# EAGLE design noroshi_LoRa (EAGLE 8.2.2)
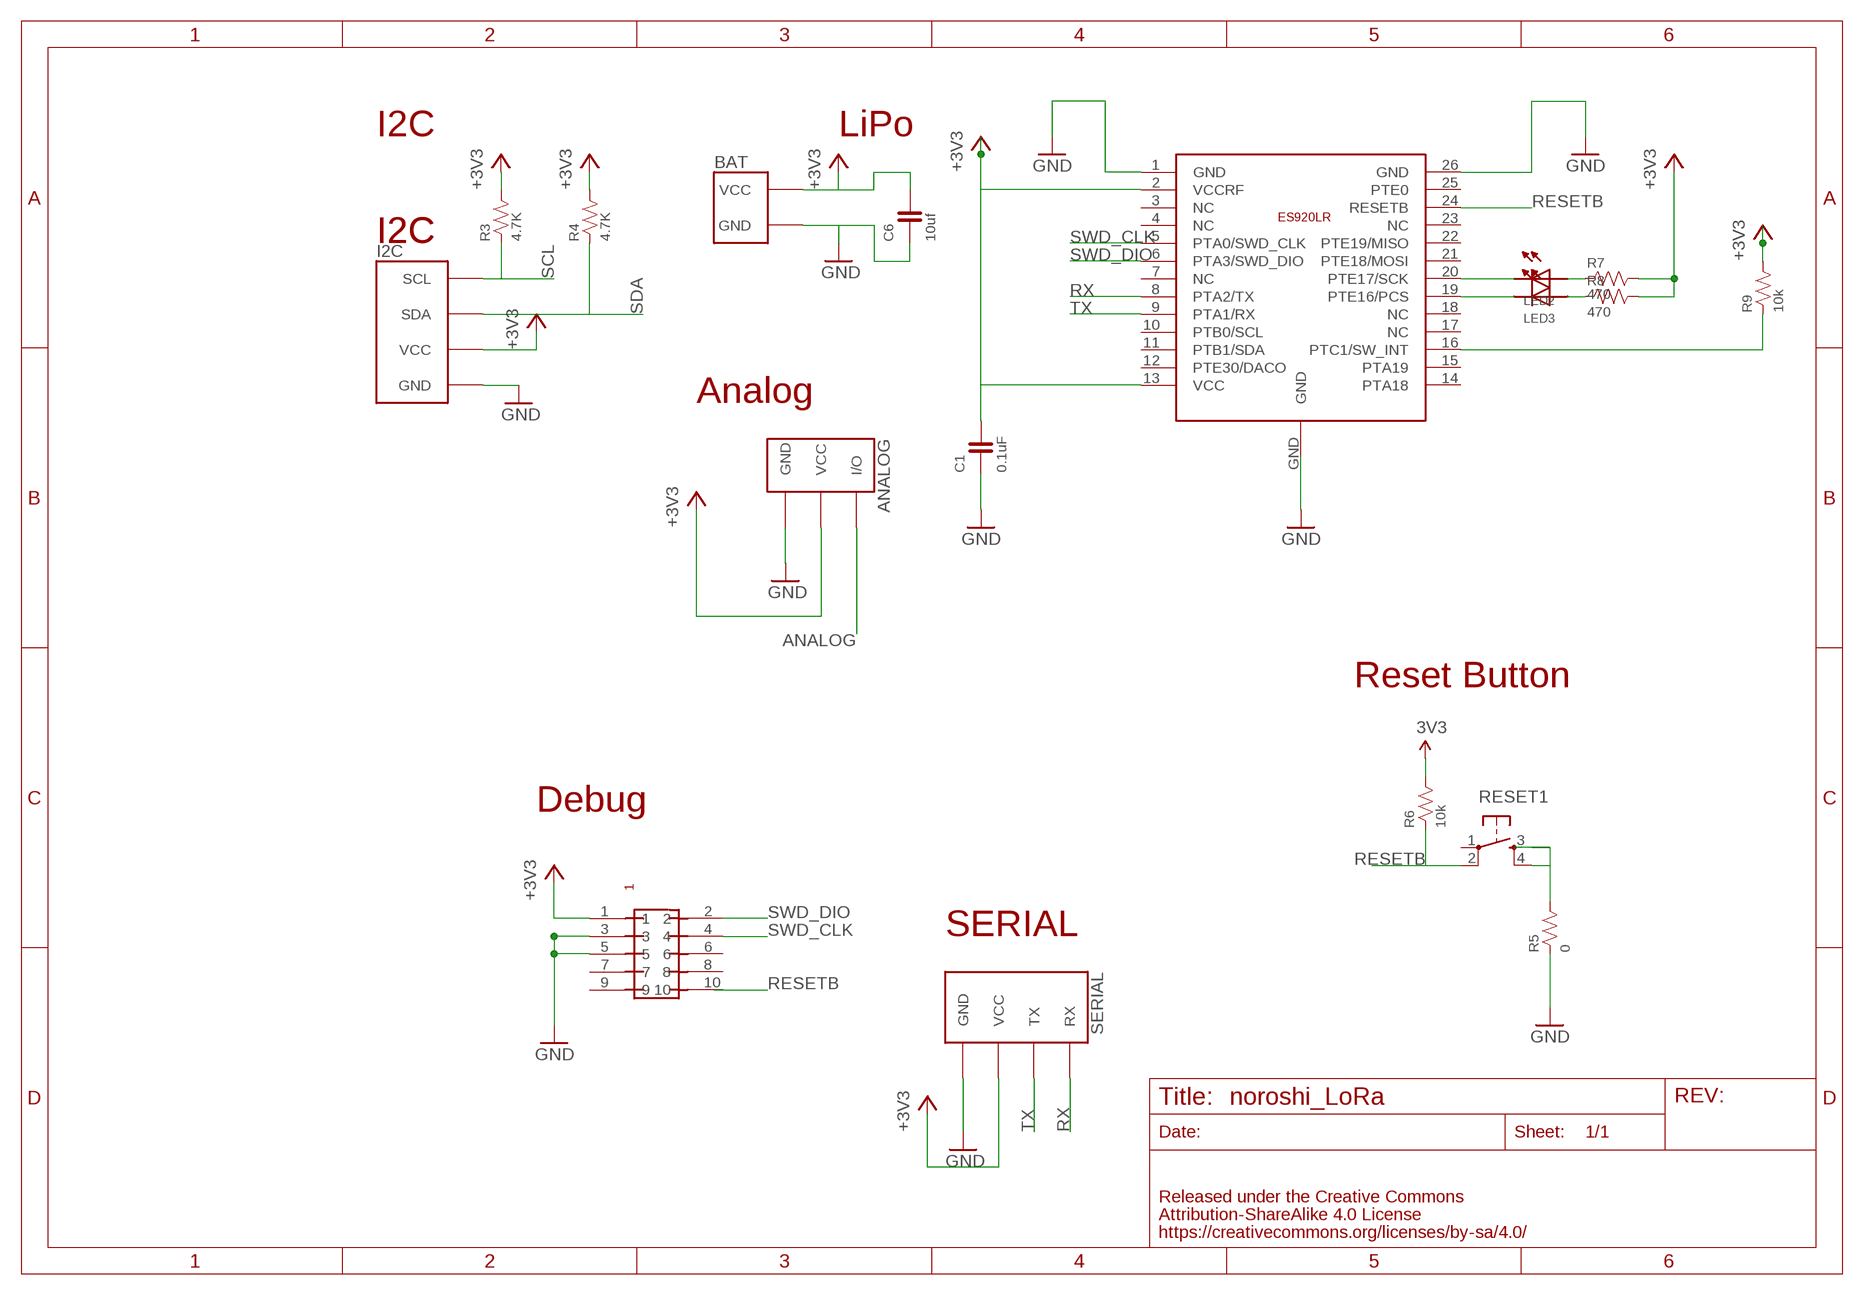
[diagram p0: schematic, sheet 1]

## Parts
ANALOG  FABO_BRICK_3PIN-S03B-PASK-2_LONG  [FABO_BRICK_3PIN_S03B-PASK-2_LONG]
BAT  FABO_BRICK_2PIN_SIDE  [FABO_BRICK_2PIN_S02B−PASK-2_SILK]
C1  0.1uF  CAPACITOR-0603_NARROW  [0603-NARROW]
C6  10uf  CAPACITOR-0603  [0603]
I2C  FABO_BRICK_I2C-S04B-PASK-2_LONG  [FABO_BRICK_I2C_S04B-PASK-2_LONG]
LED2  LED-0603  [0603]
LED3  LED-0603  [0603]
R3  4.7K  RESISTOR-0603  [0603]
R4  4.7K  RESISTOR-0603  [0603]
R5  0  RESISTOR-0603-NARROW  [0603-NARROW]
R6  10k  RESISTOR-0603-NARROW  [0603-NARROW]
R7  470  RESISTOR-0603-NARROW  [0603-NARROW]
R8  470  RESISTOR-0603-NARROW  [0603-NARROW]
R9  10k  RESISTOR-0603-NARROW  [0603-NARROW]
RESET1  TACT-SWITCH-SMD_KMR2  [KMR2]
SERIAL  FABO_BRICK_SERIAL-S04B-PASK-2_LONG  [FABO_BRICK_SERIAL_S04B-PASK-2_LONG]
U$2  ES920LR  [ES920LR]
U$8  PIN-HEADER-SMT(1.27MM)2X5  [PIN-HEADER-SMT(1.27MM)2X5]

## Nets
3V3: R6.2
+3V3: ANALOG.VCC BAT.VCC C1.2 C6.2 I2C.VCC R3.2 R4.2 R7.2 R8.2 R9.2 SERIAL.VCC U$2.2(VCCRF) U$2.13(VCC) U$8.1
ANALOG: ANALOG.I/O
GND: ANALOG.GND BAT.GND C1.1 C6.1 I2C.GND R5.1 SERIAL.GND U$2.1(GND) U$2.26(GND) U$2.GND U$8.3 U$8.5
N$4: LED3.CATHODE U$2.19(PTE16/PCS)
N$5: LED2.CATHODE U$2.20(PTE17/SCK)
N$6: LED2.ANODE R7.1
N$7: LED3.ANODE R8.1
N$8: R9.1 U$2.16(PTC1/SW_INT)
N$10: R5.2 RESET1.3 RESET1.4
RESETB: R6.1 RESET1.2 U$2.24(RESETB) U$8.10
RX: SERIAL.RX U$2.8(PTA2/TX)
SCL: I2C.SCL R3.1
SDA: I2C.SDA R4.1
SWD_CLK: U$2.5(PTA0/SWD_CLK) U$8.4
SWD_DIO: U$2.6(PTA3/SWD_DIO) U$8.2
TX: SERIAL.TX U$2.9(PTA1/RX)
Unconnected: RESET1.1 U$2.3(NC) U$2.4(NC) U$2.7(NC) U$2.10(PTB0/SCL) U$2.11(PTB1/SDA) U$2.12(PTE30/DACO) U$2.14(PTA18) U$2.15(PTA19) U$2.17(NC) U$2.18(NC) U$2.21(PTE18/MOSI) U$2.22(PTE19/MISO) U$2.23(NC) U$2.25(PTE0) U$8.6 U$8.7 U$8.8 U$8.9

## Notes on the sheet
- I2C | LiPo
- I2C | I2C
- Analog
- Reset Button
- Debug
- SERIAL

## Library data of the parts
ANALOG = FaBo-Template:FABO_BRICK_3PIN: FaBo Brick 3pin
BAT = FaBo-Template:FABO_BRICK_2PIN
C1 C6 = FaBo-Capacitor:CAPACITOR: CAPACITOR
I2C = FaBo-Template:FABO_BRICK_I2C: FaBo Brick I2C
LED2 LED3 = FaBo-LED:LED
R3-R9 = FaBo-Resistors:RESISTOR: RESISTOR
RESET1 = FaBo-Switch:TACT-SWITCH
SERIAL = FaBo-Template:FABO_BRICK_SERIAL: FaBo Brick Serial
U$2 = FaBo-LoRa:ES920LR
U$8 = gclue:PIN-HEADER-SMT(1.27MM)2X5: PIN-HEADER-SMT (1.27MM) 2x5

## Board
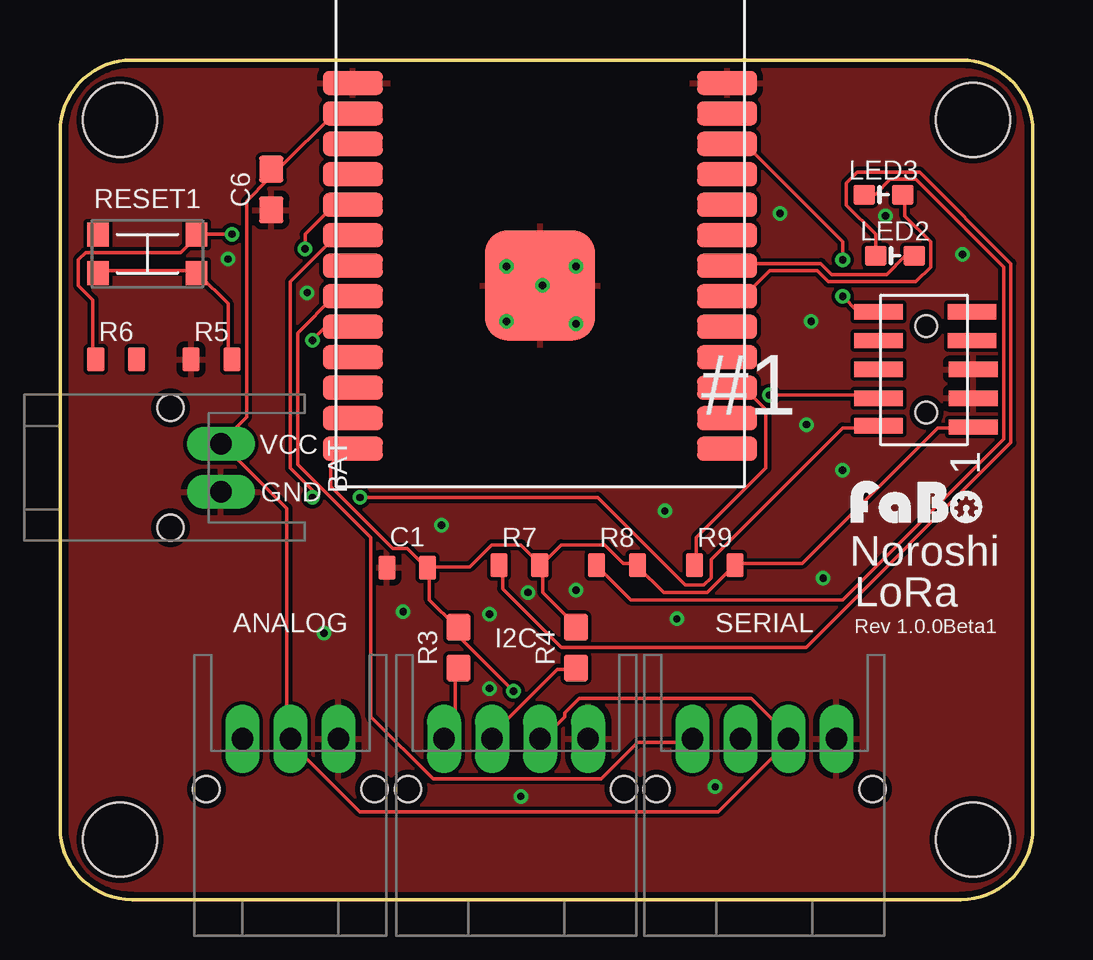
[diagram p1: board, top side]
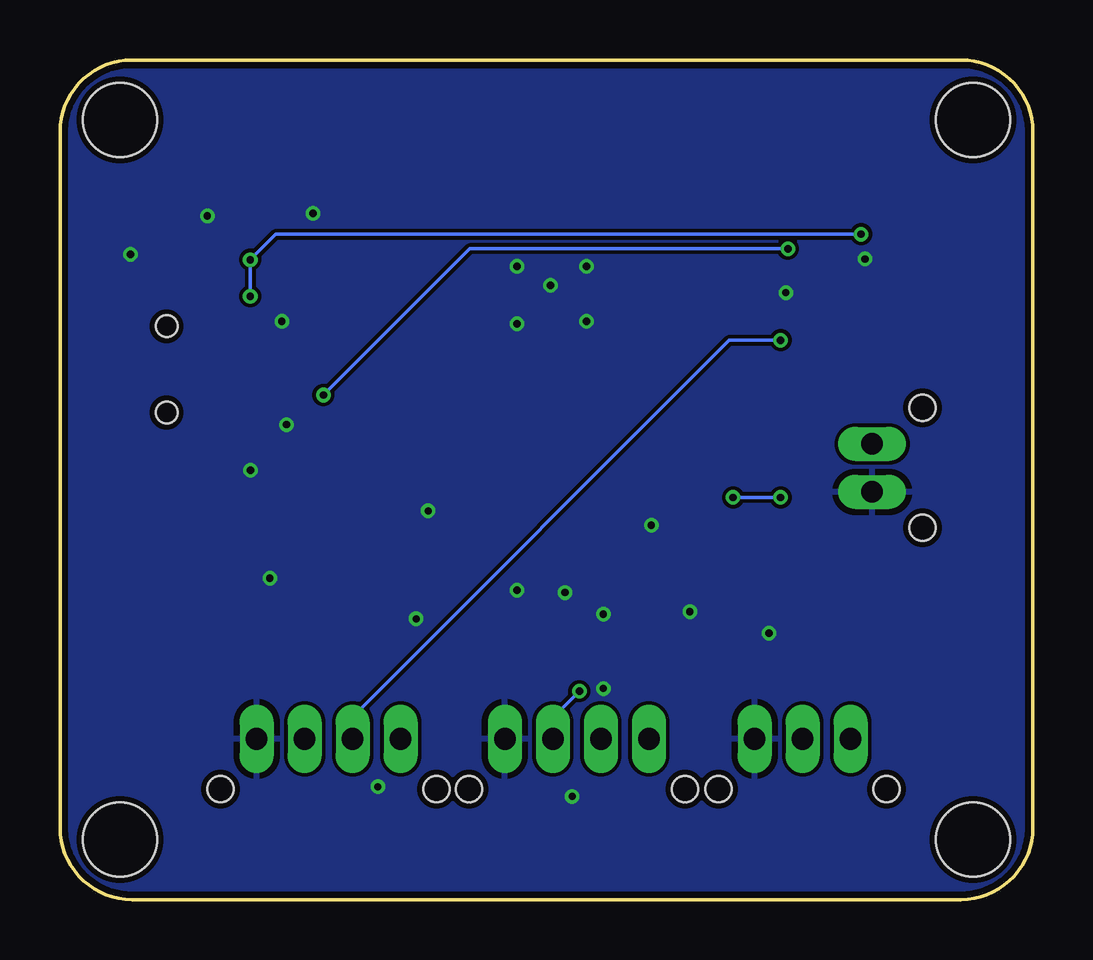
[diagram p2: board, bottom side, seen from below]

Size 40.54 x 35 mm. Coordinates in mm from the lower left corner, seen from the top.
Copper layers (1*16): Top 0.035mm / dielectric 1.5mm / Bottom 0.035mm
Design rules "SeeedStudio_2layer_DRU_no_angle_20140221": minimum track width 6mil, minimum drill 12mil, track to track 6mil, track to pad 6mil, pad to pad 6mil, via to via 6mil, smd to smd 0mil, copper to edge 10mil, drill to drill 10mil, minimum pad ring 10mil, minimum via ring 6mil, stop-mask expansion 2mil, vias tented up to drill 100mil, thermal gap 10mil

### Footprints (pad centres in the part's own frame; a part is rotated, then mirrored left to right if it is on the bottom)
FABO_BRICK_3PIN_S03B-PASK-2_LONG = drill 0.9 pad 1.422 long: GND -2,0; I/O 2,0; VCC 0,0 | hole 1.1: 3.5,2.1; -3.5,2.1
FABO_BRICK_2PIN_S02B−PASK-2_SILK = drill 0.9 pad 1.422 long: GND -1,-0.102; VCC 1,-0.102 | hole 1.1: 2.5,1.998; -2.5,1.998
0603-NARROW = smd 0.71 x 1: 1 -0.85,0; 2 0.85,0
0603 = smd 1.1 x 1: 1 -0.85,0; 2 0.85,0
FABO_BRICK_I2C_S04B-PASK-2_LONG = drill 0.9 pad 1.422 long: GND -3,0; SCL 3,0; SDA 1,0; VCC -1,0 | hole 1.1: 4.5,2.1; -4.5,2.1
0603' = smd 0.9 x 0.8: ANODE -0.8,0; CATHODE 0.8,0
KMR2 = smd 0.9 x 1: 1 -2.05,0.8; 2 2.05,0.8; 3 2.05,-0.8; 4 -2.05,-0.8
FABO_BRICK_SERIAL_S04B-PASK-2_LONG = drill 0.9 pad 1.422 long: GND -3,0; RX 3,0; TX 1,0; VCC -1,0 | hole 1.1: 4.5,2.1; -4.5,2.1
FABO-SHINOBI = hole 3.1: 2.5,32.5; 38.04,32.5; 38.04,2.5; 2.5,2.5
ES920LR = smd 2.5 x 1: 1 -7.8,5.84; 2 -7.8,4.57; 3 -7.8,3.3; 4 -7.8,2.03; 5 -7.8,0.76; 6 -7.8,-0.51; 7 -7.8,-1.78; 8 -7.8,-3.05; 9 -7.8,-4.32; 10 -7.8,-5.59; 11 -7.8,-6.86; 12 -7.8,-8.13; 13 -7.8,-9.4; 14 7.8,-9.4; 15 7.8,-8.13; 16 7.8,-6.86; 17 7.8,-5.59; 18 7.8,-4.32; 19 7.8,-3.05; 20 7.8,-1.78; 21 7.8,-0.51; 22 7.8,0.76; 23 7.8,2.03; 24 7.8,3.3; 25 7.8,4.57; 26 7.8,5.84 | smd 4.6 x 4.6: GND 0,-2.6
PIN-HEADER-SMT(1.27MM)2X5 = smd 0.635 x 2.032: 1 -2.4,-1.95; 2 -2.35,2; 3 -1.2,-1.95; 4 -1.2,2; 5 0,-1.95; 6 0,2; 7 1.2,-1.9; 8 1.2,2; 9 2.4,-1.9; 10 2.4,2 | hole 0.9: 1.8,0; -1.8,0

### Placement (x,y rotation side)
ANALOG  9.6,6.7 180 top
BAT  6.6,18 90 top
C1  14.47,13.84 0 top
C6  8.8,29.6 90 top
I2C  19,6.7 180 top
LED2  [0603']  34.79,26.84 0 top
LED3  [0603']  34.31,29.38 0 top
R3  16.6,10.5 90 top
R4  21.5,10.5 90 top
R5  6.31,22.52 0 top
R6  2.34,22.52 0 top
R7  19.14,13.94 0 top
R8  23.21,13.94 0 top
R9  27.28,13.94 0 top
RESET1  3.64,26.92 0 top
SERIAL  29.35,6.7 180 top
U$1  [FABO-SHINOBI]  0,0 0 top
U$2  20,28.2 0 top
U$3  [LOGO_FABO_S]  35.75,15.55 0 top
U$8  36.1,22.1 90 top

### Tracks (layer width: path | path; a pad name or v marks a point on that pad's centre or on a via)
+3V3  (via drill 0.3)
  Top 0.152: C1.2 15.39,13.72 15.39,12.5 16.46,11.43 R3.2 16.61,11.28 16.61,10.97 v18.9,8.69 | R7.2 20.12,13.87 20.12,12.8 21.49,11.43 R4.2 | R7.2 20.12,14.02 20.88,14.78 22.71,14.78 23.47,14.02 23.93,14.02 R8.2 24.08,13.87 25.15,12.8 26.98,12.8 28.04,13.87 R9.2 28.19,14.02 30.94,14.02 36.58,19.66 37.95,19.66 U$8.1 | C1.2 15.39,13.87 17.07,13.87 17.98,14.78 19.2,14.78 19.96,14.02 R7.2 | U$2.13 12.19,18.75 11.89,18.75 11.28,18.14 11.28,17.22 13.87,14.63 14.48,14.63 15.24,13.87 C1.2 | I2C.VCC 20.12,6.71 21.03,7.62 21.03,7.77 21.64,8.38 28.8,8.38 30.48,6.71 SERIAL.VCC 30.33,6.55 27.43,3.66 12.5,3.66 9.6,6.55 ANALOG.VCC 9.45,6.71 9.45,16.31 6.71,19.05 | U$2.2 11.43,32.77 9.14,30.48 8.84,30.48 C6.2 8.69,30.33 8.69,30.02 7.77,29.11 7.77,20.12 6.71,19.05 | 6.71,19.05 BAT.VCC
  Bottom 0.152: v18.9,8.69 19.96,7.62 19.96,6.71 I2C.VCC
GND  (via drill 0.3)
  other vias: 11,11.1 14.3,12 15.9,15.6 7,26.7 10.3,25.3 18.6,26.4 21.5,26.4 21.5,24 18.6,24.1 31.3,24.1 30,28.6 32.6,17.9 31.1,19.8 19.2,4.3 17.9,11.9 19.5,12.8 21.5,12.9 25.7,11.7 31.8,13.4 25.2,16.2 27.3,4.7 17.9,8.8 37.6,26.9 34.4,28.5 20.1,25.6
  pour Bottom: 0,0 41,0 41,36 0,36
  pour Top: 0,0 41,0 41,36 0,36
N$4
  Top 0.152: LED3.CATHODE 35.2,29.26 35.2,28.5 36.27,27.43 36.27,26.36 35.66,25.76 32,25.76 31.55,26.21 29.57,26.21 28.65,25.3 27.89,25.3 U$2.19
N$5
  Top 0.152: LED2.CATHODE 35.51,26.82 35.2,26.82 34.44,26.06 32.16,26.06 31.7,26.52 27.89,26.52 U$2.20
N$6
  Top 0.152: LED2.ANODE 33.98,26.98 33.98,27.74 32.77,28.96 32.77,29.87 33.22,30.33 35.81,30.33 39.62,26.52 39.62,19.05 31.09,10.52 20.88,10.52 18.44,12.95 18.44,13.87 R7.1
N$7
  Top 0.152: LED3.ANODE 33.53,29.41 33.98,29.41 34.59,30.02 35.66,30.02 39.32,26.36 39.32,19.2 32.61,12.5 23.77,12.5 22.4,13.87 R8.1
N$8
  Top 0.152: R9.1 26.52,14.02 26.52,15.09 29.41,17.98 29.41,20.42 28.5,21.34 27.89,21.34 U$2.16
N$10
  Top 0.152: RESET1.4 1.68,26.21 5.64,26.21 RESET1.3 5.79,26.06 7.01,24.84 7.01,22.55 R5.2
RESETB  (via drill 0.3)
  Top 0.152: R6.1 1.37,22.55 1.37,24.99 0.76,25.6 0.76,26.67 1.07,26.98 5.03,26.98 5.64,27.58 RESET1.2 5.79,27.74 v7.16,27.74 | v32.61,25.15 33.22,24.54 33.98,24.54 U$8.10 | v32.61,26.67 32.61,27.43 28.65,31.39 27.89,31.39 U$2.24
  Bottom 0.152: v32.61,25.15 v32.61,26.67 31.55,27.74 v7.16,27.74
RX
  Top 0.152: U$2.8 11.43,25.15 9.91,23.62 9.91,18.14 12.95,15.09 12.95,7.62 15.54,5.03 22.55,5.03 24.08,6.55 26.21,6.55 SERIAL.RX
SCL
  Top 0.152: R3.1 16.46,9.6 16.46,7.16 I2C.SCL
SDA
  Top 0.152: R4.1 21.49,9.6 20.73,9.6 18.14,7.01 18.14,6.71 I2C.SDA
SWD_CLK  (via drill 0.3)
  Top 0.152: v29.57,21.03 33.98,21.03 U$8.4 | v10.21,27.13 10.21,27.74 11.43,28.96 U$2.5
  Bottom 0.152: v29.57,21.03 23.47,27.13 v10.21,27.13
SWD_DIO  (via drill 0.3)
  Top 0.152: v12.5,16.76 22.4,16.76 26.06,13.11 26.82,13.11 27.13,13.41 27.13,14.17 32.61,19.66 33.98,19.66 U$8.2 | v10.52,16.76 10.52,17.07 9.6,17.98 9.6,25.76 11.43,27.58 12.19,27.58 U$2.6
  Bottom 0.152: v10.52,16.76 v12.5,16.76
TX  (via drill 0.3)
  Top 0.152: v10.52,23.32 10.97,23.77 12.19,23.77 U$2.9
  Bottom 0.152: v10.52,23.32 12.65,23.32 28.35,7.62 SERIAL.TX

### Text on the board
tPlace: #1 | Noroshi | LoRa | Rev 1.0.0Beta1